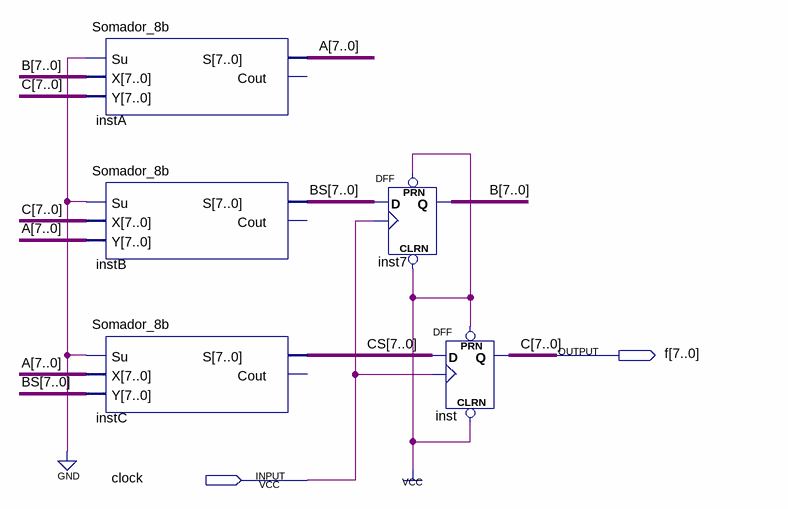
[diagram p0: schematic sheet]
// Quartus schematic Questao07.bdf as structural Verilog: 5 symbols, 2 pins
module Questao07 (
  input  clock,
  output [7:0] f
);

  wire [7:0] A, B, BS, CS;

  Somador_8b instA (.Su(1'b0), .X(B), .Y(f), .S(A));  // open: Cout
  Somador_8b instB (.Su(1'b0), .X(f), .Y(A), .S(BS));  // open: Cout
  Somador_8b instC (.Su(1'b0), .X(A), .Y(BS), .S(CS));  // open: Cout
  DFF inst7[7:0] (.CLRN(1'b1), .CLK(clock), .D(BS), .PRN(1'b1), .Q(B));
  DFF inst[7:0] (.CLRN(1'b1), .CLK(clock), .D(CS), .PRN(1'b1), .Q(f));

  // Other names for the same wires on the sheet: C[7:0] = f
endmodule
